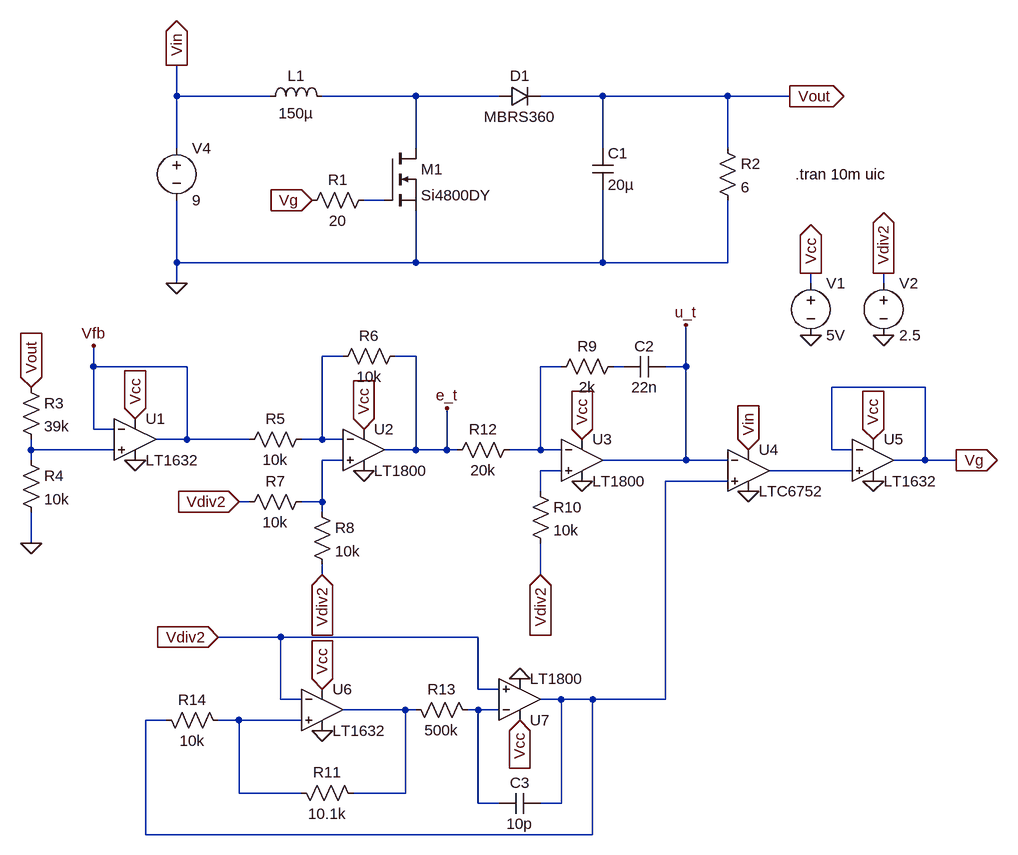
[diagram p0: schematic 07.02_2.asc]
07.02_2.asc, the LTspice schematic file:
Version 4.1
SHEET 1 1476 1620
WIRE 0 400 0 352
WIRE 144 400 0 400
WIRE 368 400 224 400
WIRE 496 400 368 400
WIRE 656 400 560 400
WIRE 848 400 656 400
WIRE 944 400 848 400
WIRE 0 480 0 400
WIRE 368 480 368 400
WIRE 656 480 656 400
WIRE 848 480 848 400
WIRE 320 560 288 560
WIRE 0 656 0 560
WIRE 368 656 368 576
WIRE 368 656 0 656
WIRE 656 656 656 544
WIRE 656 656 368 656
WIRE 848 656 848 560
WIRE 848 656 656 656
WIRE 0 688 0 656
WIRE 976 688 976 672
WIRE 1088 688 1088 672
WIRE 256 800 224 800
WIRE 368 800 336 800
WIRE -128 816 -128 784
WIRE 16 816 -128 816
WIRE 592 816 560 816
WIRE 688 816 672 816
WIRE 784 816 784 752
WIRE 784 816 752 816
WIRE 1152 848 1008 848
WIRE -128 912 -128 816
WIRE -96 912 -128 912
WIRE 16 928 16 816
WIRE 16 928 -32 928
WIRE 112 928 16 928
WIRE 224 928 224 800
WIRE 224 928 192 928
WIRE 256 928 224 928
WIRE -224 944 -224 928
WIRE -96 944 -224 944
WIRE 368 944 368 800
WIRE 368 944 320 944
WIRE 416 944 416 880
WIRE 416 944 368 944
WIRE 432 944 416 944
WIRE 560 944 560 816
WIRE 560 944 512 944
WIRE 592 944 560 944
WIRE 1008 944 1008 848
WIRE 1040 944 1008 944
WIRE -224 960 -224 944
WIRE 256 960 224 960
WIRE 784 960 784 816
WIRE 784 960 656 960
WIRE 848 960 784 960
WIRE 1152 960 1152 848
WIRE 1152 960 1104 960
WIRE 1200 960 1152 960
WIRE 592 976 560 976
WIRE 1040 976 912 976
WIRE 848 992 752 992
WIRE 560 1008 560 976
WIRE 112 1024 96 1024
WIRE 224 1024 224 960
WIRE 224 1024 192 1024
WIRE 224 1040 224 1024
WIRE -224 1088 -224 1040
WIRE 224 1136 224 1120
WIRE 560 1136 560 1088
WIRE 160 1232 64 1232
WIRE 464 1232 160 1232
WIRE 464 1312 464 1232
WIRE 496 1312 464 1312
WIRE 160 1328 160 1232
WIRE 192 1328 160 1328
WIRE 592 1328 560 1328
WIRE 640 1328 592 1328
WIRE 752 1328 752 992
WIRE 752 1328 640 1328
WIRE 352 1344 256 1344
WIRE 368 1344 352 1344
WIRE 464 1344 448 1344
WIRE 496 1344 464 1344
WIRE -16 1360 -48 1360
WIRE 96 1360 64 1360
WIRE 192 1360 96 1360
WIRE 96 1472 96 1360
WIRE 192 1472 96 1472
WIRE 352 1472 352 1344
WIRE 352 1472 272 1472
WIRE 464 1488 464 1344
WIRE 496 1488 464 1488
WIRE 592 1488 592 1328
WIRE 592 1488 560 1488
WIRE -48 1536 -48 1360
WIRE 640 1536 640 1328
WIRE 640 1536 -48 1536
FLAG 976 672 Vcc
IOPIN 976 672 Out
FLAG 976 768 0
FLAG 208 560 Vg
IOPIN 208 560 In
FLAG 0 688 0
FLAG 0 352 Vin
IOPIN 0 352 Out
FLAG 944 400 Vout
IOPIN 944 400 Out
FLAG -64 960 0
FLAG -64 896 Vcc
IOPIN -64 896 In
FLAG -224 1088 0
FLAG 288 976 0
FLAG 288 912 Vcc
IOPIN 288 912 In
FLAG 1088 672 Vdiv2
IOPIN 1088 672 Out
FLAG 1088 768 0
FLAG 96 1024 Vdiv2
IOPIN 96 1024 In
FLAG 224 1136 Vdiv2
IOPIN 224 1136 In
FLAG 624 992 0
FLAG 624 928 Vcc
IOPIN 624 928 In
FLAG 560 1136 Vdiv2
IOPIN 560 1136 In
FLAG 880 944 Vin
IOPIN 880 944 In
FLAG 880 1008 0
FLAG 1072 992 0
FLAG 1072 928 Vcc
IOPIN 1072 928 In
FLAG 224 1376 0
FLAG 224 1312 Vcc
IOPIN 224 1312 In
FLAG 528 1360 Vcc
IOPIN 528 1360 In
FLAG 528 1296 0
FLAG 64 1232 Vdiv2
IOPIN 64 1232 In
FLAG 1200 960 Vg
IOPIN 1200 960 Out
FLAG -224 848 Vout
IOPIN -224 848 In
FLAG 416 880 e_t
FLAG -128 784 Vfb
FLAG 784 752 u_t
SYMBOL voltage 976 672 R0
WINDOW 123 0 0 Left 0
WINDOW 39 0 0 Left 0
SYMATTR InstName V1
SYMATTR Value 5V
SYMBOL voltage 0 464 R0
WINDOW 123 0 0 Left 0
WINDOW 39 0 0 Left 0
SYMATTR InstName V4
SYMATTR Value 9
SYMBOL ind 128 416 R270
WINDOW 0 32 56 VTop 2
WINDOW 3 5 56 VBottom 2
SYMATTR InstName L1
SYMATTR Value 150µ
SYMATTR SpiceLine Rser=1m
SYMBOL nmos 320 480 R0
SYMATTR InstName M1
SYMATTR Value Si4800DY
SYMBOL res 304 544 R90
WINDOW 0 0 56 VBottom 2
WINDOW 3 32 56 VTop 2
SYMATTR InstName R1
SYMATTR Value 20
SYMBOL diode 496 416 R270
WINDOW 0 32 32 VTop 2
WINDOW 3 0 32 VBottom 2
SYMATTR InstName D1
SYMATTR Value MBRS360
SYMATTR Description Diode
SYMATTR Type diode
SYMBOL cap 640 480 R0
SYMATTR InstName C1
SYMATTR Value 20µ
SYMBOL res 832 464 R0
SYMATTR InstName R2
SYMATTR Value 6
SYMBOL OpAmps\\LT1632 -64 864 R0
SYMATTR InstName U1
SYMBOL res -240 832 R0
SYMATTR InstName R3
SYMATTR Value 39k
SYMBOL res -240 944 R0
SYMATTR InstName R4
SYMATTR Value 10k
SYMBOL res 208 912 R90
WINDOW 0 0 56 VBottom 2
WINDOW 3 32 56 VTop 2
SYMATTR InstName R5
SYMATTR Value 10k
SYMBOL OpAmps\\LT1800 288 880 R0
SYMATTR InstName U2
SYMBOL res 352 784 R90
WINDOW 0 0 56 VBottom 2
WINDOW 3 32 56 VTop 2
SYMATTR InstName R6
SYMATTR Value 10k
SYMBOL res 208 1008 R90
WINDOW 0 0 56 VBottom 2
WINDOW 3 32 56 VTop 2
SYMATTR InstName R7
SYMATTR Value 10k
SYMBOL voltage 1088 672 R0
WINDOW 123 0 0 Left 0
WINDOW 39 0 0 Left 0
SYMATTR InstName V2
SYMATTR Value 2.5
SYMBOL res 208 1024 R0
SYMATTR InstName R8
SYMATTR Value 10k
SYMBOL OpAmps\\LT1800 624 896 R0
SYMATTR InstName U3
SYMBOL res 688 800 R90
WINDOW 0 0 56 VBottom 2
WINDOW 3 32 56 VTop 2
SYMATTR InstName R9
SYMATTR Value 2k
SYMBOL res 544 992 R0
SYMATTR InstName R10
SYMATTR Value 10k
SYMBOL cap 752 800 R90
WINDOW 0 0 32 VBottom 2
WINDOW 3 32 32 VTop 2
SYMATTR InstName C2
SYMATTR Value 22n
SYMBOL res 528 928 R90
WINDOW 0 0 56 VBottom 2
WINDOW 3 32 56 VTop 2
SYMATTR InstName R12
SYMATTR Value 20k
SYMBOL Comparators\\LTC6752 880 912 R0
SYMATTR InstName U4
SYMBOL OpAmps\\LT1632 1072 896 R0
SYMATTR InstName U5
SYMBOL OpAmps\\LT1632 224 1280 R0
SYMATTR InstName U6
SYMBOL res 288 1488 M270
WINDOW 0 32 56 VTop 2
WINDOW 3 0 56 VBottom 2
SYMATTR InstName R11
SYMATTR Value 10.1k
SYMBOL res 464 1360 M270
WINDOW 0 32 56 VTop 2
WINDOW 3 0 56 VBottom 2
SYMATTR InstName R13
SYMATTR Value 500k
SYMBOL OpAmps\\LT1800 528 1392 M180
SYMATTR InstName U7
SYMBOL cap 560 1504 M270
WINDOW 0 32 32 VTop 2
WINDOW 3 0 32 VBottom 2
SYMATTR InstName C3
SYMATTR Value 10p
SYMBOL res 80 1376 M270
WINDOW 0 32 56 VTop 2
WINDOW 3 0 56 VBottom 2
SYMATTR InstName R14
SYMATTR Value 10k
TEXT 952 520 Left 2 !.tran 10m uic

The netlist it stands for:
* 07.02_2.asc
V1 Vcc 0 5V
V4 Vin 0 9
L1 Vin N001 150µ Rser=1m
M1 N001 N002 0 0 Si4800DY
R1 N002 Vg 20
D1 N001 Vout MBRS360
C1 Vout 0 20µ
R2 Vout 0 6
X§U1 N006 Vfb Vcc 0 Vfb LT1632  ; pins In+ In- V+ V- OUT
R3 Vout N006 39k
R4 N006 0 10k
R5 N003 Vfb 10k
X§U2 N007 N003 Vcc 0 e_t LT1800  ; pins In+ In- V+ V- OUT
R6 e_t N003 10k
R7 N007 Vdiv2 10k
V2 Vdiv2 0 2.5
R8 N007 Vdiv2 10k
X§U3 N008 N004 Vcc 0 u_t LT1800  ; pins In+ In- V+ V- OUT
R9 N005 N004 2k
R10 N008 Vdiv2 10k
C2 u_t N005 22n
R12 N004 e_t 20k
X§U4 N010 u_t Vin 0 N009 LTC6752  ; pins In+ In- V+ V- OUT
X§U5 N009 Vg Vcc 0 Vg LT1632  ; pins In+ In- V+ V- OUT
X§U6 N013 Vdiv2 Vcc 0 N011 LT1632  ; pins In+ In- V+ V- OUT
R11 N011 N013 10.1k
R13 N012 N011 500k
X§U7 Vdiv2 N012 Vcc 0 N010 LT1800  ; pins In+ In- V+ V- OUT
C3 N010 N012 10p
R14 N013 N010 10k
.model D D
.lib standard.dio
.model NMOS NMOS
.model PMOS PMOS
.lib standard.mos
.tran 10m uic
.lib LTC.lib
.lib LTC7.lib
.backanno
.end